# Altium schematic sheet IR_CONTROLLER.SchDoc: IR_CONTROLLER
size 420 x 297 mm; Engineer: ALPER KORKMAZ; SheetNumber: 3; SheetTotal: 8; SHEET: 3
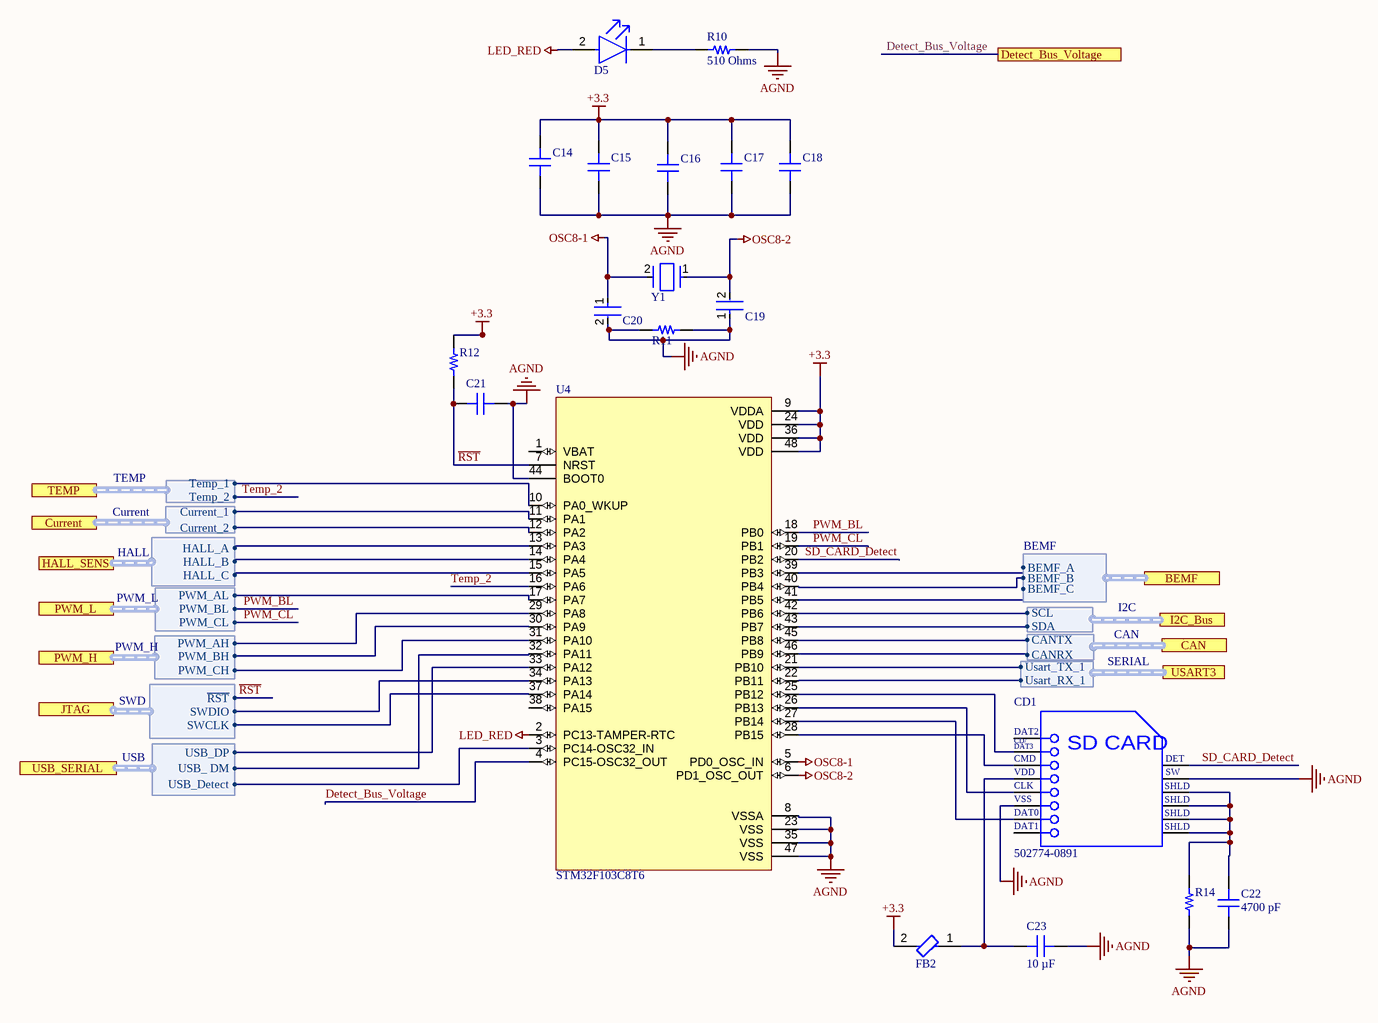
[diagram p0: IR_CONTROLLER.SchDoc]

## Parts
C14  0.1 µF  [CAP 0603_1608]  (value not drawn)
C15  0.1 µF  [CAP 0603_1608]  (value not drawn)
C16  0.1 µF  [CAP 0603_1608]  (value not drawn)
C17  0.1 µF  [CAP 0603_1608]  (value not drawn)
C18  10 µF  [CAP 0603_1608]  (value not drawn)
C19  10pF  [FP-C0805C-DN-MFG]  (value not drawn)
C20  10pF  [FP-C0805C-DN-MFG]  (value not drawn)
C21  100 nF  [CAP 0603_1608]  (value not drawn)
C22  4700 pF  [CAP 0805_2012]
C23  10 µF  [CAP 0603_1608]
CD1  502774-0891  [MOLX-502774-0891_V]
D5  CMD15-21VRD/TR8  [FP-CMD15-21-MFG]  (value not drawn)
FB2  BLM18PG330SN1D  [FP-BLM18-0_15-t0_8-d1_2-MFG]  (value not drawn)
R10  510 Ohms  [RES 0603_1608]
R11  1M Ohms  [RES 0603_1608]  (value not drawn)
R12  4.7 kOhms  [RES 0603_1608]  (value not drawn)
R14  1 MOhms  [RES 0603_1608]  (value not drawn)
U4  STM32F103C8T6  [QFN48-(7mmX7mm)]
Y1  ABM3-8.000MHZ-D2Y-T  [FP-ABM3-MFG]  (value not drawn)

## Ports
BEMF (harness BEMF, see 1[4C], 4[5C]), CAN (harness CAN, see 1[3B], 6[1C]), Current (harness Current, see 1[3C], 8[3A]), Detect_Bus_Voltage (see 1[3B], 2[6B]), HALL_SENS (harness HALL, see 1[4C]), I2C_Bus (harness I2C, see 1[3C], 7[2A]), JTAG (harness SWD, see 1[4D]), PWM_H (harness PWM_H, see 1[4B], 5[5C]), PWM_L (harness PWM_L, see 1[4B], 5[5C]), TEMP (harness TEMP, see 1[3C], 7[3A]), USART3 (harness SERIAL, see 1[3B], 6[1A]), USB_SERIAL (harness USB, see 1[3B], 2[5C])

## Harnesses
HALL: HALL_C, HALL_B, HALL_A
SWD: SWCLK, SWDIO, ~{RST}
PWM_H: PWM_CH, PWM_BH, PWM_AH
BEMF: BEMF_A, BEMF_B, BEMF_C
USB: USB_Detect, USB_ DM, USB_DP
PWM_L: PWM_CL, PWM_BL, PWM_AL
I2C: SDA, SCL
Current: Current_1, Current_2
CAN: CANRX, CANTX
SERIAL: Usart_RX_1, Usart_TX_1
TEMP: Temp_1, Temp_2

## Nets
+3.3: C14.2 C15.2 C16.2 C17.2 C18.2 FB2.2 R12.2 U4.9(VDDA) U4.24(VDD) U4.36(VDD) U4.48(VDD)
AGND: C14.1 C15.1 C16.1 C17.1 C18.1 C19.1 C20.2 C21.1 C22.1 C23.2 CD1.6(VSS) CD1.10(SWITCH) R10.2 R11.1 R11.2 R14.1 U4.8(VSSA) U4.23(VSS) U4.35(VSS) U4.44(BOOT0) U4.47(VSS)
LED_RED: D5.2(A) U4.2(PC13-TAMPER-RTC)
OSC8-1: C20.1 U4.5(PD0_OSC_IN) Y1.2
OSC8-2: C19.2 U4.6(PD1_OSC_OUT) Y1.1
Detect_Bus_Voltage: U4.4(PC15-OSC32_OUT) ; port Detect_Bus_Voltage
PWM_BL: U4.18(PB0) ; port PWM_L.PWM_BL
PWM_CL: U4.19(PB1) ; port PWM_L.PWM_CL
~{RST}: C21.2 R12.1 U4.7(NRST) ; port JTAG.~{RST}
SD_CARD_Detect: CD1.9(DETECT) U4.20(PB2)
Temp_2: U4.16(PA6) ; port TEMP.Temp_2
NetC22_2: C22.2 CD1.11(SHLD) CD1.12(SHLD) CD1.13(SHLD) CD1.14(SHLD) R14.2
NetC23_1: C23.1 CD1.4(VDD) FB2.1
NetCD1_2: CD1.2(CD/DAT3) U4.25(PB12)
NetCD1_3: CD1.3(CMD) U4.28(PB15)
NetCD1_5: CD1.5(CLK) U4.26(PB13)
NetCD1_7: CD1.7(DAT0) U4.27(PB14)
NetD5_1: D5.1(C) R10.1
NetU4_3: U4.3(PC14-OSC32_IN) ; port USB_SERIAL.USB_Detect
NetU4_10: U4.10(PA0_WKUP) ; port TEMP.Temp_1
NetU4_11: U4.11(PA1) ; port Current.Current_1
NetU4_12: U4.12(PA2) ; port Current.Current_2
NetU4_13: U4.13(PA3) ; port HALL_SENS.HALL_A
NetU4_14: U4.14(PA4) ; port HALL_SENS.HALL_B
NetU4_15: U4.15(PA5) ; port HALL_SENS.HALL_C
NetU4_17: U4.17(PA7) ; port PWM_L.PWM_AL
NetU4_21: U4.21(PB10) ; port USART3.Usart_TX_1
NetU4_22: U4.22(PB11) ; port USART3.Usart_RX_1
NetU4_29: U4.29(PA8) ; port PWM_H.PWM_AH
NetU4_30: U4.30(PA9) ; port PWM_H.PWM_BH
NetU4_31: U4.31(PA10) ; port PWM_H.PWM_CH
NetU4_32: U4.32(PA11) ; port USB_SERIAL.USB_ DM
NetU4_33: U4.33(PA12) ; port USB_SERIAL.USB_DP
NetU4_34: U4.34(PA13) ; port JTAG.SWDIO
NetU4_37: U4.37(PA14) ; port JTAG.SWCLK
NetU4_39: U4.39(PB3) ; port BEMF.BEMF_A
NetU4_40: U4.40(PB4) ; port BEMF.BEMF_B
NetU4_41: U4.41(PB5) ; port BEMF.BEMF_C
NetU4_42: U4.42(PB6) ; port I2C_Bus.SCL
NetU4_43: U4.43(PB7) ; port I2C_Bus.SDA
NetU4_45: U4.45(PB8) ; port CAN.CANTX
NetU4_46: U4.46(PB9) ; port CAN.CANRX

Not connected (* = marked no-connect by the designer): CD1 1(DAT2) 8(DAT1); U4 1(VBAT) 38(PA15)

## Notes on the sheet
- THIS DOCUMENT AND THE DATA DISCLOSED HEREIN OR
- HEREWITH IS THE PROPERTY OF IRRESISTIBLE FUTURE AND MAY
- DWG NO:
- REVISION
- REV:
- DESCRIPTION
- DATE
- APPROVED
- BE FREELY DISTRIBUTED IN WHOLE. NO RIGHTS ARE
- RESERVED OR EXPRESS OR IMPLIED WARANTEE GIVEN.
- PROJECT
- Drawn by
- TITLE
- SCALE:
- A3
- SIZE
- Checked by
- FILE NAME
- SHEET
- OF
- 1:1
- 10
- (in symbol CMP-2000-05248-1) CD/; DAT3; SD CARD; DET; SW

## Library data of the parts
C14-C17 = CS0603KRX7R7BB104: CAP CER 0.1UF 16V X7R 0603; Part Number: CS0603KRX7R7BB104; Value: 0.1 µF
C18 C21 = GRM188C80E106ME47D: CAP CER 10UF 2.5V X6S 0603; Part Number: GRM188C80E106ME47D
  C18: Value: 10 µF
  C21: Value: 100 nF
C19 C20 = CMP-2007-00219-2: Capacitor; Ceramic; Cap 10 pF; Tol 5%; Vol-Rtg 50 VDC; SMT; 0805; COG (NPO); Tape&Reel; Manufacturer Part Number: C0805C100J5GACTU; Manufacturer: KEMET; Temperature Coefficient: 30ppm/°C; Voltage Rating: 50 V; Tolerance: 0.05; Temperature Characteristic: C0G; RoHS: TRUE; Mouser Description: KEMET - C0805C100J5GACTU - CAP, MLCC, C0G/NP0, 10PF, 50V, 0805; Temperature Range High: +125°C; Octopart: https://octopart.com/c0805c100j5gactu-kemet-104357; Automotive: No; Device Class L1: Passive Components; Temperature Range Low: -55°C; Value: 10 pF; Device Class L3: Ceramic Capacitors; Material: Ceramic; Device Class L2: Capacitors; Lead Free: Yes; Category: Cap; Ipc Land Pattern Name: CAPC200125X78; ComponentLink2Description: Datasheet; ComponentLink2URL: https://content.kemet.com/datasheets/KEM_C1003_C0G_SMD.pdf; Digikey Description: Capacitor; Ceramic; Cap 10 pF; Tol 5%; Vol-Rtg 50 VDC; SMT; 0805; COG (NPO); Tape&Reel; Temperature: -55°C to +125°C; Height: 0.88mm; Capacitance: 10 pF; Package: C0805C-DN
C22 = C0805C472K5RACAUTO: CAP CER 4700PF 50V X7R 0805; manufacturer: KEMET; Tolerance: ±10%; Part Number: C0805C472K5RACAUTO; Value: 4700 pF; Applications: Automotive, Bypass, Decoupling; Capacitance: 4700 pF; componentlink1description: Datasheet; componentlink1url: https://api.kemet.com/component-edge/download/datasheet/C0805C472K5RACAUTO.pdf; componentlink2description: DigiKey Link; componentlink2url: https://www.digikey.com/en/products/detail/kemet/C0805C472K5RACAUTO/3314962; Device Package: 0805 (2012 Metric); lastupdated: 13.07.2022 13:50:26; Lifecycle Status: Active; Minimum Order: 1; Mounting Type: Surface Mount, MLCC; Operating Temperature: -55°C ~ 125°C; Package / Case: 0805 (2012 Metric); packaging: TapeAndReel; partid: 2514; Part Status: Active; price: 0.01; Ratings: AEC-Q200; series: SMD Auto X7R; Size / Dimension: 0.079" L x 0.049" W (2.00mm x 1.25mm); Supplier 1: DigiKey; Supplier Part Number 1: 399-6969-1-ND; Temperature Coefficient: X7R; Thickness (Max): 0.035" (0.88mm); Voltage - Rated: 50V
C23 = GRM188R60J106ME47D: CAP CER 10UF 6.3V X5R 0603; manufacturer: Murata Electronics; Tolerance: ±20%; Part Number: GRM188R60J106ME47D; Value: 10 µF; Applications: General Purpose; Capacitance: 10 µF; componentlink1description: Datasheet; componentlink1url: https://www.murata.com/~/media/webrenewal/support/library/catalog/products/capacitor/mlcc/c02e.ashx?la=en-us; componentlink2description: DigiKey Link; componentlink2url: https://www.digikey.com/en/products/detail/murata-electronics/GRM188R60J106ME47D/965910; Device Package: 0603 (1608 Metric); lastupdated: 13.07.2022 13:47:07; Lifecycle Status: Active; Minimum Order: 1; Mounting Type: Surface Mount, MLCC; Operating Temperature: -55°C ~ 85°C; Package / Case: 0603 (1608 Metric); packaging: TapeAndReel; partid: 2351; Part Status: Active; price: 0.03; series: GRM; Size / Dimension: 0.063" L x 0.031" W (1.60mm x 0.80mm); Supplier 1: DigiKey; Supplier Part Number 1: 490-3896-1-ND; Temperature Coefficient: X5R; Thickness (Max): 0.035" (0.90mm); Voltage - Rated: 6.3V
CD1 = CMP-2000-05248-1: Micro SD Memory Card Connector, 0.5 A, 10 V (DC), -25 to 85 degC, 8-Pin SMT, RoHS, Tape and Reel; Manufacturer: Molex; 3D Model: 502774-0891.stp; Online Catalog: microSD™Series; Number of Positions: 10(8+2); Card Type: SecureDigital-microSD™; Insertion, Removal Method: PushIn,PushOut; Other Names: WM24066DKR; Connector Type: ConnectorandEjector; Features: Switch; Family: MemoryConnectors-PCCardSockets; Manufacturer URL: http://www.molex.com/; Mounting Type: SurfaceMount,RightAngle; Contact Finish Thickness: 20µin(0.51µm); Standard Package: 1; Series: 502774; Ejector Side: -; Datasheet Version: Rev. D, 04/2004; Category: Connectors,Interconnects; Contact Finish: Gold; Datasheet URL: https://datasheet.ciiva.com/1104/1499551-1104671.pdf; RoHS Information: 502774-0891CertofCompliance; Mounting Feature: Reverse-Bottom; Packaging: Digi-Reel; Height Above Board: 0.071"(1.80mm); Catalog Drawings: 502774-0891
D5 = CMP-53976-000002-1: LED RED DIFFUSED 1206 SMD; Manufacturer: VCC; Led Orientation: Top View; Peak Emmision Wavelength: 640nm; Forward Current: 20mA; Power Dissipation: 105mW; Luminous Intensity: 4mcd; Forward Voltage: 2V; Reverse Voltage: 5V; Lead Free: Yes; Device Class L1: Optoelectronics; Package: CMD15-21; Temperature Range High: +85°C; Digikey Description: LED RED DIFFUSED 1206 SMD; Mouser Description: Standard LEDs - SMD RED DIFFUSED; Height: 1.3mm; ComponentLink2Description: Datasheet; Manufacturer Part Number: CMD15-21VRD/TR8; ComponentLink2URL: https://www.vcclite.com/wp-content/uploads/wpallimport/files/files/CMD1521SeriesRev1.pdf; Temperature: -40°C to +85°C; Automotive: No; Octopart: https://octopart.com/cmd15-21vrd%2Ftr8-vcc-26668835; Temperature Range Low: -40°C; Device Class L3: unset; Colour: Red; Category: Diode; Device Class L2: LEDs; RoHS: TRUE
FB2 = CMP-0686-00590-4: Chip Ferrite Bead, 0603, 33Ω @ 100MHz, 0.025Ω, 25%, 3A; Manufacturer Series: BLM18P; Shielding: Unshielded; Number of Functions: 1; Resistance: 25mR; ESR (Equivalent Series Resistance): 33R; Material: Steel; Packaging: Tape and Reel; Test Frequency: 100MHz; Length: 1.6mm; DC Current: 3A; Height: 0.8mm; Current Rating: 3A; Case/Package: 0603; Number of Lines: 1; Lead Free: Lead Free; RoHS Compliant: Yes; Max Current Rating: 3A; Case Code (Metric): 1608; Core Material: Ferrite; REACH SVHC: No SVHC; Min Operating Temperature: -55°C; Number of Pins: 2; DC Resistance (DCR): 25mR; Number of Circuits: 1; Series: BLM18P; Radiation Hardening: No; Max DC Current: 3A; Depth: 0.8mm; Terminal Finish: Tin; Package Quantity: 1; Case Code (Imperial): 0603; Impedance: 33R; Tolerance: 25%; Width: 0.8mm; Termination: SMD/SMT; DC Resistance-Max: 25mR; Max Operating Temperature: 125°C
R10 R11 = RNCS0603BKE10K0: RES 10K OHM 0.1% 1/16W 0603; Manufacturer: Stackpole Electronics Inc; Power (Watts): 0.063W, 1/16W; Resistance: 10 kOhms; Temperature Coefficient: ±25ppm/°C; Part Number: RNCS0603BKE10K0; ComponentLink1Description: Datasheet; ComponentLink1URL: https://www.seielect.com/catalog/sei-rncs_rnch.pdf; ComponentLink2Description: DigiKey Link; ComponentLink2URL: https://www.digikey.com/en/products/detail/stackpole-electronics-inc/RNCS0603BKE10K0/1708836; Composition: Thin Film; Device Package: 0603 (1608 Metric); Features: Anti-Corrosive, Automotive AEC-Q200, Moisture Resistant; Height - Seated (Max): 0.022" (0.55mm); LastUpdated: 23.05.2022 13:14:49; Lifecycle Status: Active; Minimum Order: 1; Number of Terminations: 2; Operating Temperature: -55°C ~ 155°C; Package / Case: 0603 (1608 Metric); Packaging: TapeAndReel; PartId: 4838; Part Status: Active; Price: 0.08; Ratings: AEC-Q200; Series: RNCS; Size / Dimension: 0.061" L x 0.031" W (1.55mm x 0.80mm); Supplier 1: DigiKey; Supplier Part Number 1: RNCS0603BKE10K0CT-ND; Supplier Device Package: 0603; Tolerance: ±0.1%
  R10: Value: 510 Ohms
  R11: Value: 1M Ohms
R12 = CPF0603B4K7E1: RES SMD 4.7K OHM 0.1% 1/16W 0603; Manufacturer: TE Connectivity Passive Product; Power (Watts): 0.063W, 1/16W; Temperature Coefficient: ±25ppm/°C; Part Number: CPF0603B4K7E1; Value: 4.7 kOhms; ComponentLink1Description: Datasheet; ComponentLink1URL: https://www.te.com/commerce/DocumentDelivery/DDEController?Action=srchrtrv&DocNm=1773200&DocType=DS&DocLang=English; ComponentLink2Description: DigiKey Link; ComponentLink2URL: https://www.digikey.com/en/products/detail/te-connectivity-passive-product/CPF0603B4K7E1/2381934; Composition: Thin Film; Device Package: 0603 (1608 Metric); Height - Seated (Max): 0.022" (0.55mm); LastUpdated: 30.06.2022 22:25:17; Lifecycle Status: Active; Minimum Order: 1; Number of Terminations: 2; Operating Temperature: -55°C ~ 155°C; Package / Case: 0603 (1608 Metric); Packaging: TapeAndReel; PartId: 5789; Part Status: Active; Price: 0.13; Resistance: 4.7 kOhms; Series: CPF, Neohm; Size / Dimension: 0.061" L x 0.031" W (1.55mm x 0.80mm); Supplier 1: DigiKey; Supplier Part Number 1: A103105CT-ND; Supplier Device Package: 0603; Tolerance: ±0.1%
R14 = RT0603BRD071ML: RES SMD 1M OHM 0.1% 1/10W 0603; Manufacturer: Yageo; Power (Watts): 0.1W, 1/10W; Temperature Coefficient: ±25ppm/°C; Part Number: RT0603BRD071ML; Value: 1 MOhms; ComponentLink1Description: Datasheet; ComponentLink1URL: https://www.yageo.com/upload/media/product/productsearch/datasheet/rchip/PYu-RT_1-to-0.01_RoHS_L_11.pdf; ComponentLink2Description: DigiKey Link; ComponentLink2URL: http://digikey.com/product-detail/en/yageo/RT0603BRD071ML/YAG4498CT-ND/6616654; Composition: Thin Film; Device Package: 0603 (1608 Metric); Height - Seated (Max): 0.022" (0.55mm); LastUpdated: 11.07.2022 15:05:15; Lifecycle Status: Active; Minimum Order: 1; Number of Terminations: 2; Operating Temperature: -55°C ~ 155°C; Package / Case: 0603 (1608 Metric); Packaging: TapeAndReel; PartId: 5503; Part Status: Active; Price: 0.03; Resistance: 1 MOhms; Series: RT; Size / Dimension: 0.063" L x 0.031" W (1.60mm x 0.80mm); Supplier 1: DigiKey; Supplier Part Number 1: YAG4498CT-ND; Supplier Device Package: 0603; Tolerance: ±0.1%
U4 = STM32F103C8T6: IC MCU 32-Bit 72MHz 64kB FLASH LQFP48; MF: STMicroelectronics; RAM Size: 20KB; Max Power Dissipation: 363mW; Interface: I2C,SPI,USB,CAN,IrDA,UART,USART,LIN; Number of I/Os: 37; Number of Timers/Counters: 4; Max Supply Voltage: 3.6V; Number of ADC Channels: 10; Min Supply Voltage: 2V; Oscillator Type: Internal; Number of Programmable I/O: 48; Data Bus Width: 32b; Number of Bits: 32; Watchdog Timer: Yes; Peripherals: POR,PWM,WDT,DMA,Temp Sensor,I2C; Core Architecture: ARM; Number of PWM Channels: 1; Number of SPI Channels: 2; Price: None; Package: LQFP-48 STMicroelectronics; Value: *; MP: STM32F103C8T6; Availability: Unavailable; Supplier 1: Digi-Key; Manufacturer: STMicroelectronics; Manufacturer Part Number: STM32F103C8T6; RoHS: Yes; Category: Microcontrollers; Pricing 1: 1=7,00000, 10=6,28800, 25=5,94440, 80=5,15175, 250=4,88756, 500=4,40320 (USD); Case/Package: LQFP; Number of Pins: 48; Min Operating Temperature: -40°C; Max Operating Temperature: 85°C; Frequency: 72MHz; Packaging: Tray; Package Quantity: 250; Density: 64KB; Memory Type: FLASH; Max Frequency: 72MHz; Memory Size: 64KB; Termination: SMD/SMT; Number of I2C Channels: 2; Address Bus Width: 32b; Length: 7mm; Width: 7.2mm; Height: 1.45mm; Radiation Hardening: No; Lead Free: Lead Free; REACH SVHC: No SVHC; ComponentLink1URL: https://datasheet.ciiva.com/15122/getdatasheetpartid-69880-15122076.pdf?src-supplier=Verical; ComponentLink1Description: https://datasheet.ciiva.com/15122/getdatasheetpartid-69880-15122076.pdf?src-supplier=Verical; ComponentLink2URL: https://datasheet.ciiva.com/26816/stm32f103c8t6-26816902.pdf?src-supplier=IIIC; ComponentLink2Description: https://datasheet.ciiva.com/26816/stm32f103c8t6-26816902.pdf?src-supplier=IIIC; ComponentLink3URL: https://datasheet.ciiva.com/16210/cd00161566-16210248.pdf?src-supplier=Future+Electronics; ComponentLink3Description: https://datasheet.ciiva.com/16210/cd00161566-16210248.pdf?src-supplier=Future+Electronics; ComponentLink4URL: https://datasheet.ciiva.com/14100/pustm-arm-microcont-stm32f103-en-14100508.pdf?src-supplier=Distrelec; ComponentLink4Description: https://datasheet.ciiva.com/14100/pustm-arm-microcont-stm32f103-en-14100508.pdf?src-supplier=Distrelec; ComponentLink5URL: https://datasheet.ciiva.com/8054/1730126-8054942.pdf?src-supplier=Element14; ComponentLink5Description: https://datasheet.ciiva.com/8054/1730126-8054942.pdf?src-supplier=Element14; ComponentLink6URL: https://datasheet.ciiva.com/48687/001075658-da-01-en-mcu-64kb-mem-stm32f103c8t6-lqfp-48-stm-48687589.pdf?src-supplier=Conrad; ComponentLink6Description: https://datasheet.ciiva.com/48687/001075658-da-01-en-mcu-64kb-mem-stm32f103c8t6-lqfp-48-stm-48687589.pdf?src-supplier=Conrad; Supplier Part Number 1: 497-6063-ND
Y1 = CMP-2000-05033-2: Crystal 8MHz ±20ppm 18pF SMD-2 5mm x 3.2mm; Series Resistance: 500R; Frequency Stability: 30ppm; ESR (Equivalent Series Resistance): 140R; Load Capacitance: 18pF; Height: 0.051inch; Tolerance: 20ppm; Depth: 3.2mm; Max Operating Temperature: 85°C; Frequency: 8MHz; Termination: SMD/SMT; Lead Free: Lead Free; Number of Pins: 2; Width: 3.2mm; RoHS Compliant: Yes; Resistor Type: Ceramic; Length: 5mm; Mount: Surface Mount; Case/Package: CSMD; Package Quantity: 1000; Radiation Hardening: No; Min Operating Temperature: -40°C; Packaging: Tape and Reel; Frequency Tolerance: 20ppm